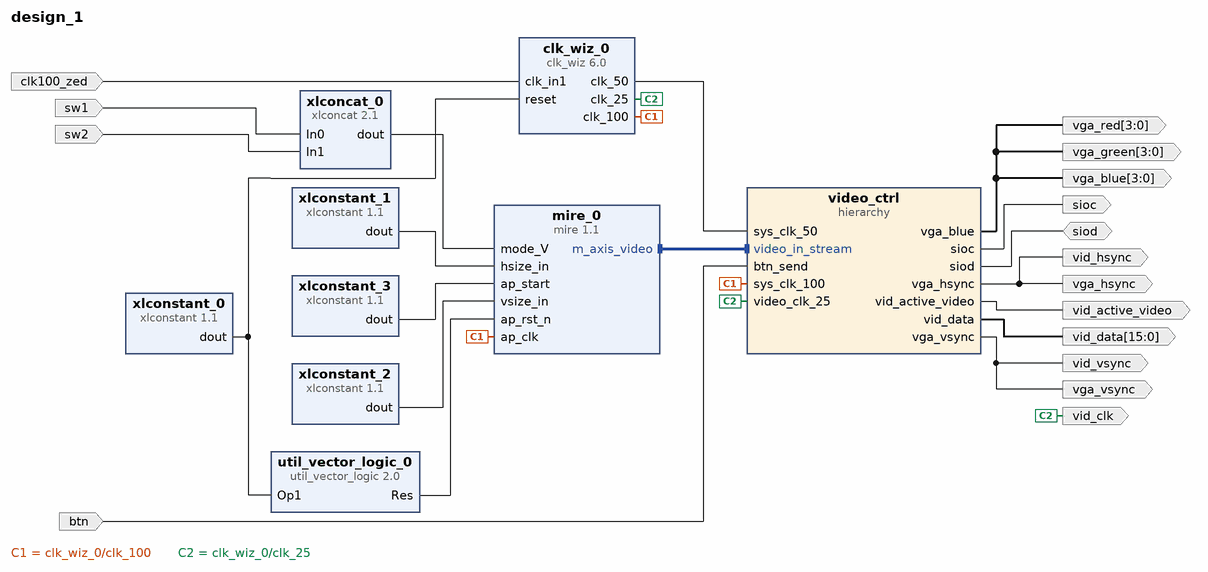
[diagram p0: block diagram of the top level]
# Vivado block design design_1, xc7z020clg484-1, Vivado 2019.2
create_bd_design design_1

create_bd_port -dir I -type clk clk100_zed
create_bd_port -dir O -from 3 -to 0 vga_red
create_bd_port -dir O -from 3 -to 0 vga_green
create_bd_port -dir O -from 3 -to 0 vga_blue
create_bd_port -dir O vga_hsync
create_bd_port -dir O vga_vsync
create_bd_port -dir I sw1
create_bd_port -dir O -from 15 -to 0 vid_data
create_bd_port -dir O vid_hsync
create_bd_port -dir O vid_vsync
create_bd_port -dir O vid_clk
create_bd_port -dir O vid_active_video
create_bd_port -dir IO siod
create_bd_port -dir O sioc
create_bd_port -dir I btn
create_bd_port -dir I sw2

create_bd_cell -type ip -vlnv xilinx.com:ip:clk_wiz:6.0 clk_wiz_0
set_property -dict [list \
  CONFIG.CLKOUT1_JITTER 130.958 \
  CONFIG.CLKOUT1_REQUESTED_OUT_FREQ 100.000 \
  CONFIG.CLKOUT2_JITTER 151.636 \
  CONFIG.CLKOUT2_PHASE_ERROR 98.575 \
  CONFIG.CLKOUT2_REQUESTED_OUT_FREQ 50.000 \
  CONFIG.CLKOUT2_USED true \
  CONFIG.CLKOUT3_JITTER 175.402 \
  CONFIG.CLKOUT3_PHASE_ERROR 98.575 \
  CONFIG.CLKOUT3_REQUESTED_OUT_FREQ 25.000 \
  CONFIG.CLKOUT3_USED true \
  CONFIG.CLK_OUT1_PORT clk_100 \
  CONFIG.CLK_OUT2_PORT clk_50 \
  CONFIG.CLK_OUT3_PORT clk_25 \
  CONFIG.MMCM_CLKOUT0_DIVIDE_F 10.000 \
  CONFIG.MMCM_CLKOUT1_DIVIDE 20 \
  CONFIG.MMCM_CLKOUT2_DIVIDE 40 \
  CONFIG.NUM_OUT_CLKS 3 \
] [get_bd_cells clk_wiz_0]
create_bd_cell -type ip -vlnv xilinx.com:ip:xlconstant:1.1 xlconstant_0
set_property -dict {CONFIG.CONST_VAL 0} [get_bd_cells xlconstant_0]
create_bd_cell -type hier video_ctrl
create_bd_cell -type ip -vlnv xilinx.com:ip:util_vector_logic:2.0 util_vector_logic_0
set_property -dict {CONFIG.C_OPERATION not CONFIG.C_SIZE 1} [get_bd_cells util_vector_logic_0]
create_bd_cell -type ip -vlnv xilinx.com:ip:xlconstant:1.1 xlconstant_1
set_property -dict {CONFIG.CONST_VAL 640 CONFIG.CONST_WIDTH 32} [get_bd_cells xlconstant_1]
create_bd_cell -type ip -vlnv xilinx.com:ip:xlconstant:1.1 xlconstant_2
set_property -dict {CONFIG.CONST_VAL 480 CONFIG.CONST_WIDTH 32} [get_bd_cells xlconstant_2]
create_bd_cell -type ip -vlnv xilinx.com:ip:xlconstant:1.1 xlconstant_3
create_bd_cell -type ip -vlnv xilinx.com:hls:mire:1.1 mire_0
create_bd_cell -type ip -vlnv xilinx.com:ip:xlconcat:2.1 xlconcat_0

# ---- hierarchy /video_ctrl ----
current_bd_instance /video_ctrl
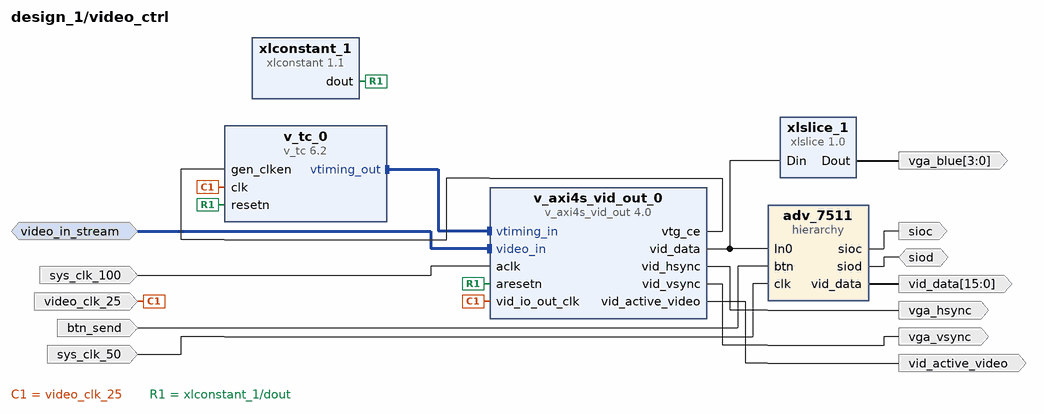
[diagram p1: block diagram inside /video_ctrl]
create_bd_intf_pin -mode Slave -vlnv xilinx.com:interface:axis_rtl:1.0 video_in_stream
create_bd_pin -dir O -from 3 -to 0 vga_blue
create_bd_pin -dir I -type clk video_clk_25
create_bd_pin -dir O vga_hsync
create_bd_pin -dir O vga_vsync
create_bd_pin -dir I -type clk sys_clk_100
create_bd_pin -dir O vid_active_video
create_bd_pin -dir O -from 15 -to 0 vid_data
create_bd_pin -dir I btn_send
create_bd_pin -dir IO siod
create_bd_pin -dir O sioc
create_bd_pin -dir I -type clk sys_clk_50

create_bd_cell -type ip -vlnv xilinx.com:ip:xlslice:1.0 xlslice_1
set_property -dict {CONFIG.DIN_FROM 7 CONFIG.DIN_TO 4 CONFIG.DIN_WIDTH 8 CONFIG.DOUT_WIDTH 4} [get_bd_cells xlslice_1]
create_bd_cell -type ip -vlnv xilinx.com:ip:xlconstant:1.1 xlconstant_1
create_bd_cell -type ip -vlnv xilinx.com:ip:v_tc:6.2 v_tc_0
set_property -dict [list \
  CONFIG.FSYNC_VSTART0 524 \
  CONFIG.HAS_AXI4_LITE false \
  CONFIG.VIDEO_MODE 480p \
  CONFIG.enable_detection false \
  CONFIG.horizontal_blank_generation true \
  CONFIG.vertical_blank_generation true \
] [get_bd_cells v_tc_0]
create_bd_cell -type ip -vlnv xilinx.com:ip:v_axi4s_vid_out:4.0 v_axi4s_vid_out_0
set_property -dict {CONFIG.C_HAS_ASYNC_CLK 1 CONFIG.C_S_AXIS_VIDEO_FORMAT 12} [get_bd_cells v_axi4s_vid_out_0]
create_bd_cell -type hier adv_7511

# ---- hierarchy /video_ctrl/adv_7511 ----
current_bd_instance /video_ctrl/adv_7511
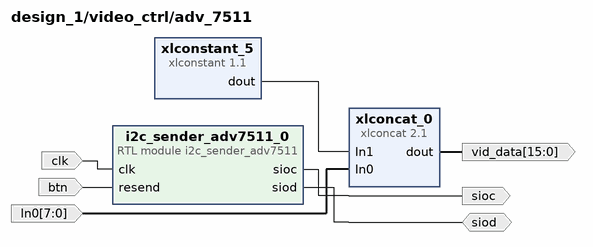
[diagram p2: block diagram inside /video_ctrl/adv_7511]
create_bd_pin -dir I -from 7 -to 0 In0
create_bd_pin -dir O -from 15 -to 0 vid_data
create_bd_pin -dir I -type clk clk
create_bd_pin -dir I btn
create_bd_pin -dir O sioc
create_bd_pin -dir IO siod

create_bd_cell -type ip -vlnv xilinx.com:ip:xlconcat:2.1 xlconcat_0
set_property -dict {CONFIG.IN0_WIDTH 8 CONFIG.IN1_WIDTH 8} [get_bd_cells xlconcat_0]
create_bd_cell -type module -reference i2c_sender_adv7511 i2c_sender_adv7511_0
create_bd_cell -type ip -vlnv xilinx.com:ip:xlconstant:1.1 xlconstant_5
set_property -dict {CONFIG.CONST_VAL 127 CONFIG.CONST_WIDTH 8} [get_bd_cells xlconstant_5]

# ---- connections ----

current_bd_instance /video_ctrl
connect_bd_intf_net [get_bd_intf_pins v_tc_0/vtiming_out] [get_bd_intf_pins v_axi4s_vid_out_0/vtiming_in]
connect_bd_intf_net [get_bd_intf_pins video_in_stream] [get_bd_intf_pins v_axi4s_vid_out_0/video_in]
connect_bd_net [get_bd_pins xlslice_1/Dout] [get_bd_pins vga_blue]
connect_bd_net -net clk_wiz_0_clk_25 [get_bd_pins video_clk_25] [get_bd_pins v_tc_0/clk] [get_bd_pins v_axi4s_vid_out_0/vid_io_out_clk]
connect_bd_net [get_bd_pins v_axi4s_vid_out_0/vtg_ce] [get_bd_pins v_tc_0/gen_clken]
connect_bd_net -net wr_clk_1 [get_bd_pins sys_clk_100] [get_bd_pins v_axi4s_vid_out_0/aclk]
connect_bd_net [get_bd_pins v_axi4s_vid_out_0/vid_hsync] [get_bd_pins vga_hsync]
connect_bd_net [get_bd_pins v_axi4s_vid_out_0/vid_vsync] [get_bd_pins vga_vsync]
connect_bd_net [get_bd_pins xlconstant_1/dout] [get_bd_pins v_tc_0/resetn] [get_bd_pins v_axi4s_vid_out_0/aresetn]
connect_bd_net [get_bd_pins v_axi4s_vid_out_0/vid_data] [get_bd_pins xlslice_1/Din] [get_bd_pins adv_7511/In0]
connect_bd_net [get_bd_pins v_axi4s_vid_out_0/vid_active_video] [get_bd_pins vid_active_video]
connect_bd_net -net xlconcat_0_dout [get_bd_pins adv_7511/vid_data] [get_bd_pins vid_data]
connect_bd_net -net btn_1 [get_bd_pins btn_send] [get_bd_pins adv_7511/btn]
connect_bd_net [get_bd_pins siod] [get_bd_pins adv_7511/siod]
connect_bd_net -net i2c_sender_adv7511_0_sioc [get_bd_pins adv_7511/sioc] [get_bd_pins sioc]
connect_bd_net -net clk_1 [get_bd_pins sys_clk_50] [get_bd_pins adv_7511/clk]

current_bd_instance /video_ctrl/adv_7511
connect_bd_net [get_bd_pins xlconstant_5/dout] [get_bd_pins xlconcat_0/In1]
connect_bd_net -net v_axi4s_vid_out_0_vid_data [get_bd_pins In0] [get_bd_pins xlconcat_0/In0]
connect_bd_net [get_bd_pins xlconcat_0/dout] [get_bd_pins vid_data]
connect_bd_net [get_bd_pins clk] [get_bd_pins i2c_sender_adv7511_0/clk]
connect_bd_net [get_bd_pins btn] [get_bd_pins i2c_sender_adv7511_0/resend]
connect_bd_net [get_bd_pins i2c_sender_adv7511_0/sioc] [get_bd_pins sioc]
connect_bd_net [get_bd_pins siod] [get_bd_pins i2c_sender_adv7511_0/siod]

current_bd_instance /
connect_bd_intf_net [get_bd_intf_pins mire_0/m_axis_video] [get_bd_intf_pins video_ctrl/video_in_stream]
connect_bd_net -net clk_in1_0_1 [get_bd_ports clk100_zed] [get_bd_pins clk_wiz_0/clk_in1]
connect_bd_net [get_bd_pins xlconstant_0/dout] [get_bd_pins clk_wiz_0/reset] [get_bd_pins util_vector_logic_0/Op1]
connect_bd_net -net v_tc_0_vsync_out [get_bd_pins video_ctrl/vga_vsync] [get_bd_ports vga_vsync] [get_bd_ports vid_vsync]
connect_bd_net -net xlslice_1_Dout [get_bd_pins video_ctrl/vga_blue] [get_bd_ports vga_red] [get_bd_ports vga_green] [get_bd_ports vga_blue]
connect_bd_net -net v_tc_0_hsync_out [get_bd_pins video_ctrl/vga_hsync] [get_bd_ports vga_hsync] [get_bd_ports vid_hsync]
connect_bd_net [get_bd_pins clk_wiz_0/clk_100] [get_bd_pins video_ctrl/sys_clk_100] [get_bd_pins mire_0/ap_clk]
connect_bd_net [get_bd_pins video_ctrl/vid_active_video] [get_bd_ports vid_active_video]
connect_bd_net [get_bd_pins clk_wiz_0/clk_50] [get_bd_pins video_ctrl/sys_clk_50]
connect_bd_net -net i_0_1 [get_bd_ports btn] [get_bd_pins video_ctrl/btn_send]
connect_bd_net [get_bd_pins video_ctrl/vid_data] [get_bd_ports vid_data]
connect_bd_net [get_bd_ports siod] [get_bd_pins video_ctrl/siod]
connect_bd_net [get_bd_pins video_ctrl/sioc] [get_bd_ports sioc]
connect_bd_net [get_bd_pins clk_wiz_0/clk_25] [get_bd_pins video_ctrl/video_clk_25] [get_bd_ports vid_clk]
connect_bd_net -net sw1_1 [get_bd_ports sw1] [get_bd_pins xlconcat_0/In0]
connect_bd_net -net sw2_1 [get_bd_ports sw2] [get_bd_pins xlconcat_0/In1]
connect_bd_net [get_bd_pins xlconcat_0/dout] [get_bd_pins mire_0/mode_V]
connect_bd_net [get_bd_pins util_vector_logic_0/Res] [get_bd_pins mire_0/ap_rst_n]
connect_bd_net [get_bd_pins xlconstant_1/dout] [get_bd_pins mire_0/hsize_in]
connect_bd_net [get_bd_pins xlconstant_3/dout] [get_bd_pins mire_0/ap_start]
connect_bd_net [get_bd_pins xlconstant_2/dout] [get_bd_pins mire_0/vsize_in]

validate_bd_design
save_bd_design
